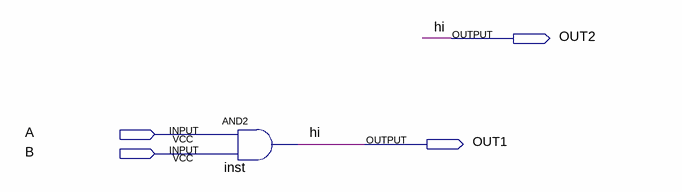
[diagram p0: schematic sheet]
// Quartus schematic test.bdf as structural Verilog: 1 symbols, 4 pins
module test (
  input  A,
  input  B,
  output OUT2,
  output OUT1
);

  and inst (OUT1, A, B);

  assign OUT2 = OUT1;

  // Other names for the same wires on the sheet: hi = OUT1
endmodule
